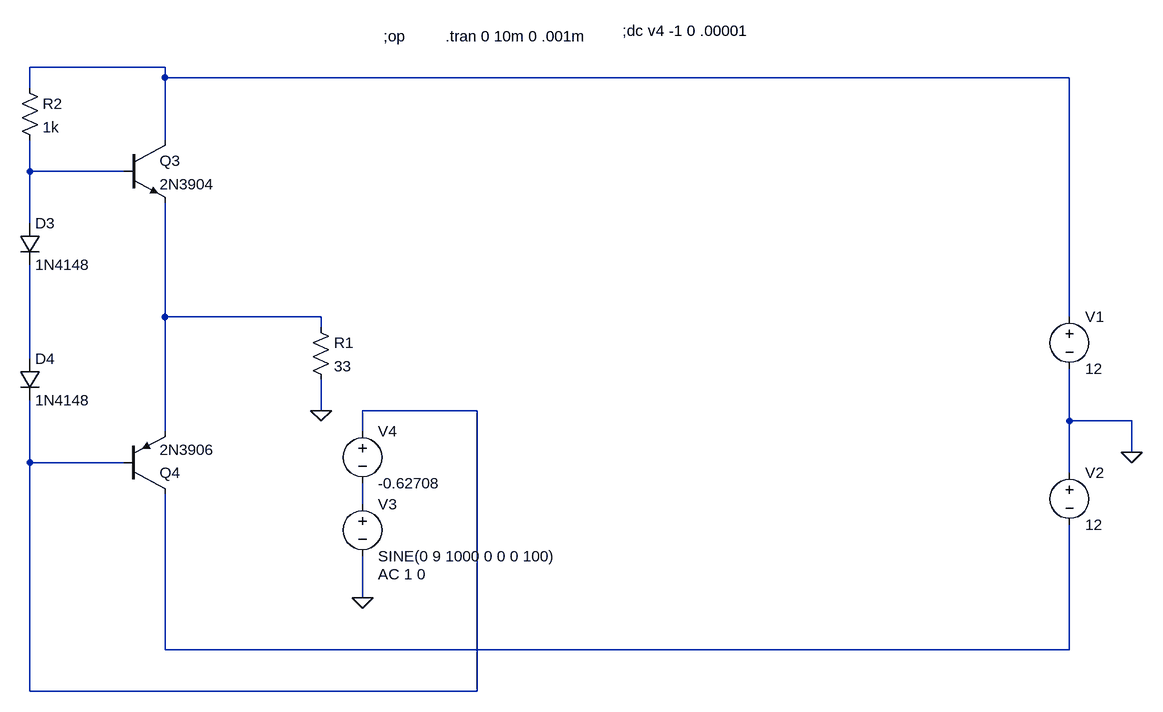
[diagram p0: schematic claseab9b.asc]
claseab9b.asc, the LTspice schematic file:
Version 4
SHEET 1 1172 680
WIRE -336 -560 -544 -560
WIRE -336 -544 -336 -560
WIRE 1056 -544 -336 -544
WIRE -544 -528 -544 -560
WIRE -336 -448 -336 -544
WIRE -544 -400 -544 -448
WIRE -480 -400 -544 -400
WIRE -400 -400 -480 -400
WIRE -544 -320 -544 -400
WIRE -336 -176 -336 -352
WIRE -272 -176 -336 -176
WIRE -96 -176 -272 -176
WIRE 1056 -176 1056 -544
WIRE -96 -160 -96 -176
WIRE -544 -112 -544 -256
WIRE -96 -32 -96 -80
WIRE 144 -32 -32 -32
WIRE 1056 -16 1056 -96
WIRE 1152 -16 1056 -16
WIRE -336 0 -336 -176
WIRE -32 0 -32 -32
WIRE 1152 32 1152 -16
WIRE -544 48 -544 -48
WIRE -480 48 -544 48
WIRE -400 48 -480 48
WIRE 1056 64 1056 -16
WIRE -32 112 -32 80
WIRE -32 256 -32 192
WIRE -336 336 -336 96
WIRE 1056 336 1056 144
WIRE 1056 336 -336 336
WIRE -544 400 -544 48
WIRE 144 400 144 -32
WIRE 144 400 -544 400
FLAG 1152 32 0
FLAG -32 256 0
FLAG -96 -32 0
DATAFLAG -272 -176 ""
DATAFLAG -480 48 ""
DATAFLAG -480 -400 ""
SYMBOL voltage 1056 -192 R0
WINDOW 123 0 0 Left 2
WINDOW 39 0 0 Left 2
SYMATTR InstName V1
SYMATTR Value 12
SYMBOL voltage 1056 48 R0
WINDOW 123 0 0 Left 2
WINDOW 39 0 0 Left 2
SYMATTR InstName V2
SYMATTR Value 12
SYMBOL voltage -32 96 R0
WINDOW 123 24 124 Left 2
WINDOW 39 0 0 Left 2
SYMATTR Value2 AC 1 0
SYMATTR InstName V3
SYMATTR Value SINE(0 9 1000 0 0 0 100)
SYMBOL voltage -32 -16 R0
WINDOW 123 0 0 Left 2
WINDOW 39 0 0 Left 2
SYMATTR InstName V4
SYMATTR Value -0.62708
SYMBOL npn -400 -448 R0
SYMATTR InstName Q3
SYMATTR Value 2N3904
SYMBOL pnp -400 96 M180
SYMATTR InstName Q4
SYMATTR Value 2N3906
SYMBOL res -112 -176 R0
SYMATTR InstName R1
SYMATTR Value 33
SYMBOL diode -560 -320 R0
SYMATTR InstName D3
SYMATTR Value 1N4148
SYMBOL diode -560 -112 R0
SYMATTR InstName D4
SYMATTR Value 1N4148
SYMBOL res -560 -544 R0
SYMATTR InstName R2
SYMATTR Value 1k
TEXT 0 -608 Left 2 !;op
TEXT 368 -616 Left 2 !;dc v4 -1 0 .00001
TEXT 96 -608 Left 2 !.tran 0 10m 0 .001m

The netlist it stands for:
* claseab9b.asc
V1 N001 0 12
V2 0 N007 12
V3 N006 0 SINE(0 9 1000 0 0 0 100) AC 1 0
V4 N005 N006 -0.62708
Q3 N001 N002 N003 0 2N3904
Q4 N007 N005 N003 0 2N3906
R1 N003 0 33
D3 N002 N004 1N4148
D4 N004 N005 1N4148
R2 N001 N002 1k
.model D D
.lib standard.dio
.model NPN NPN
.model PNP PNP
.lib standard.bjt
;op
;dc v4 -1 0 .00001
.tran 0 10m 0 .001m
.backanno
.end